# EAGLE design probatio_base (EAGLE 9.4.0)
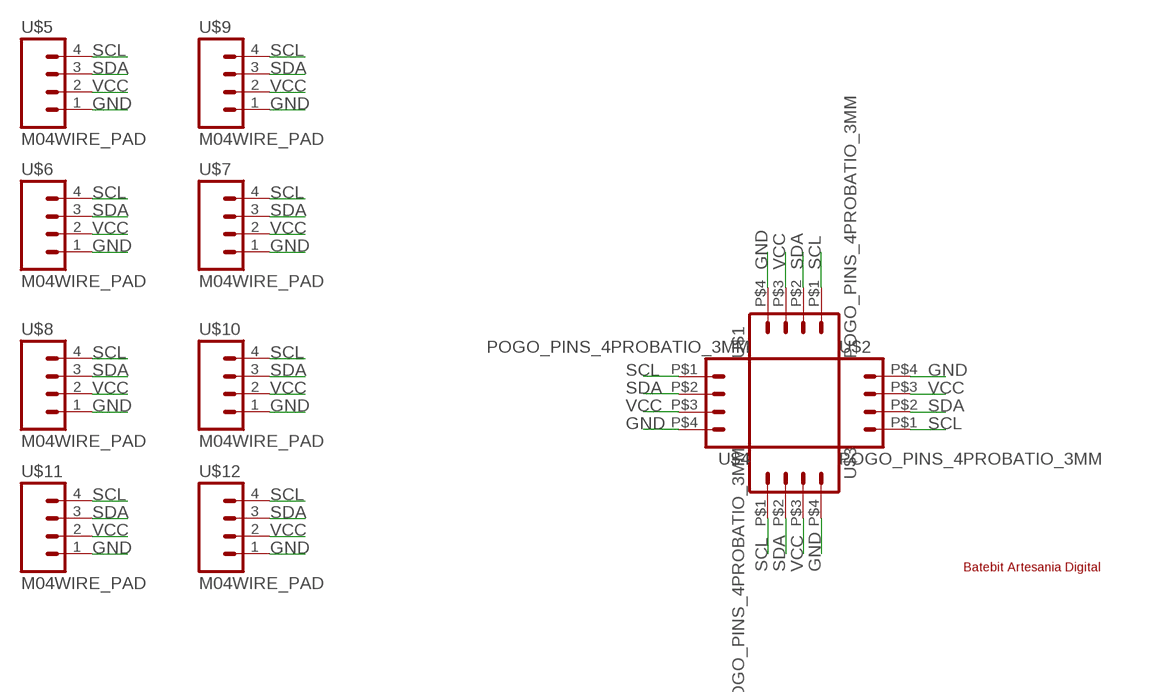
[diagram p0: schematic, sheet 1]

## Parts
U$1  POGO_PINS_4PROBATIO_3MM  [POGO-PINS-4]
U$2  POGO_PINS_4PROBATIO_3MM  [POGO-PINS-4]
U$3  POGO_PINS_4PROBATIO_3MM  [POGO-PINS-4]
U$4  POGO_PINS_4PROBATIO_3MM  [POGO-PINS-4]
U$5  M04WIRE_PAD  [1X04_SMD]
U$6  M04WIRE_PAD  [1X04_SMD]
U$7  M04WIRE_PAD  [1X04_SMD]
U$8  M04WIRE_PAD  [1X04_SMD]
U$9  M04WIRE_PAD  [1X04_SMD]
U$10  M04WIRE_PAD  [1X04_SMD]
U$11  M04WIRE_PAD  [1X04_SMD]
U$12  M04WIRE_PAD  [1X04_SMD]
U$13  BATEBIT_PEQ  [BATEBIT_PEQ]

## Nets
GND: U$1.P$4 U$2.P$4 U$3.P$4 U$4.P$4 U$5.1 U$6.1 U$7.1 U$8.1 U$9.1 U$10.1 U$11.1 U$12.1
SCL: U$1.P$1 U$2.P$1 U$3.P$1 U$4.P$1 U$5.4 U$6.4 U$7.4 U$8.4 U$9.4 U$10.4 U$11.4 U$12.4
SDA: U$1.P$2 U$2.P$2 U$3.P$2 U$4.P$2 U$5.3 U$6.3 U$7.3 U$8.3 U$9.3 U$10.3 U$11.3 U$12.3
VCC: U$1.P$3 U$2.P$3 U$3.P$3 U$4.P$3 U$5.2 U$6.2 U$7.2 U$8.2 U$9.2 U$10.2 U$11.2 U$12.2

## Library data of the parts
U$1-U$4 = Batebit:POGO_PINS_4
U$5-U$12 = Batebit:M04
U$13 = Batebit:BATEBIT

## Board
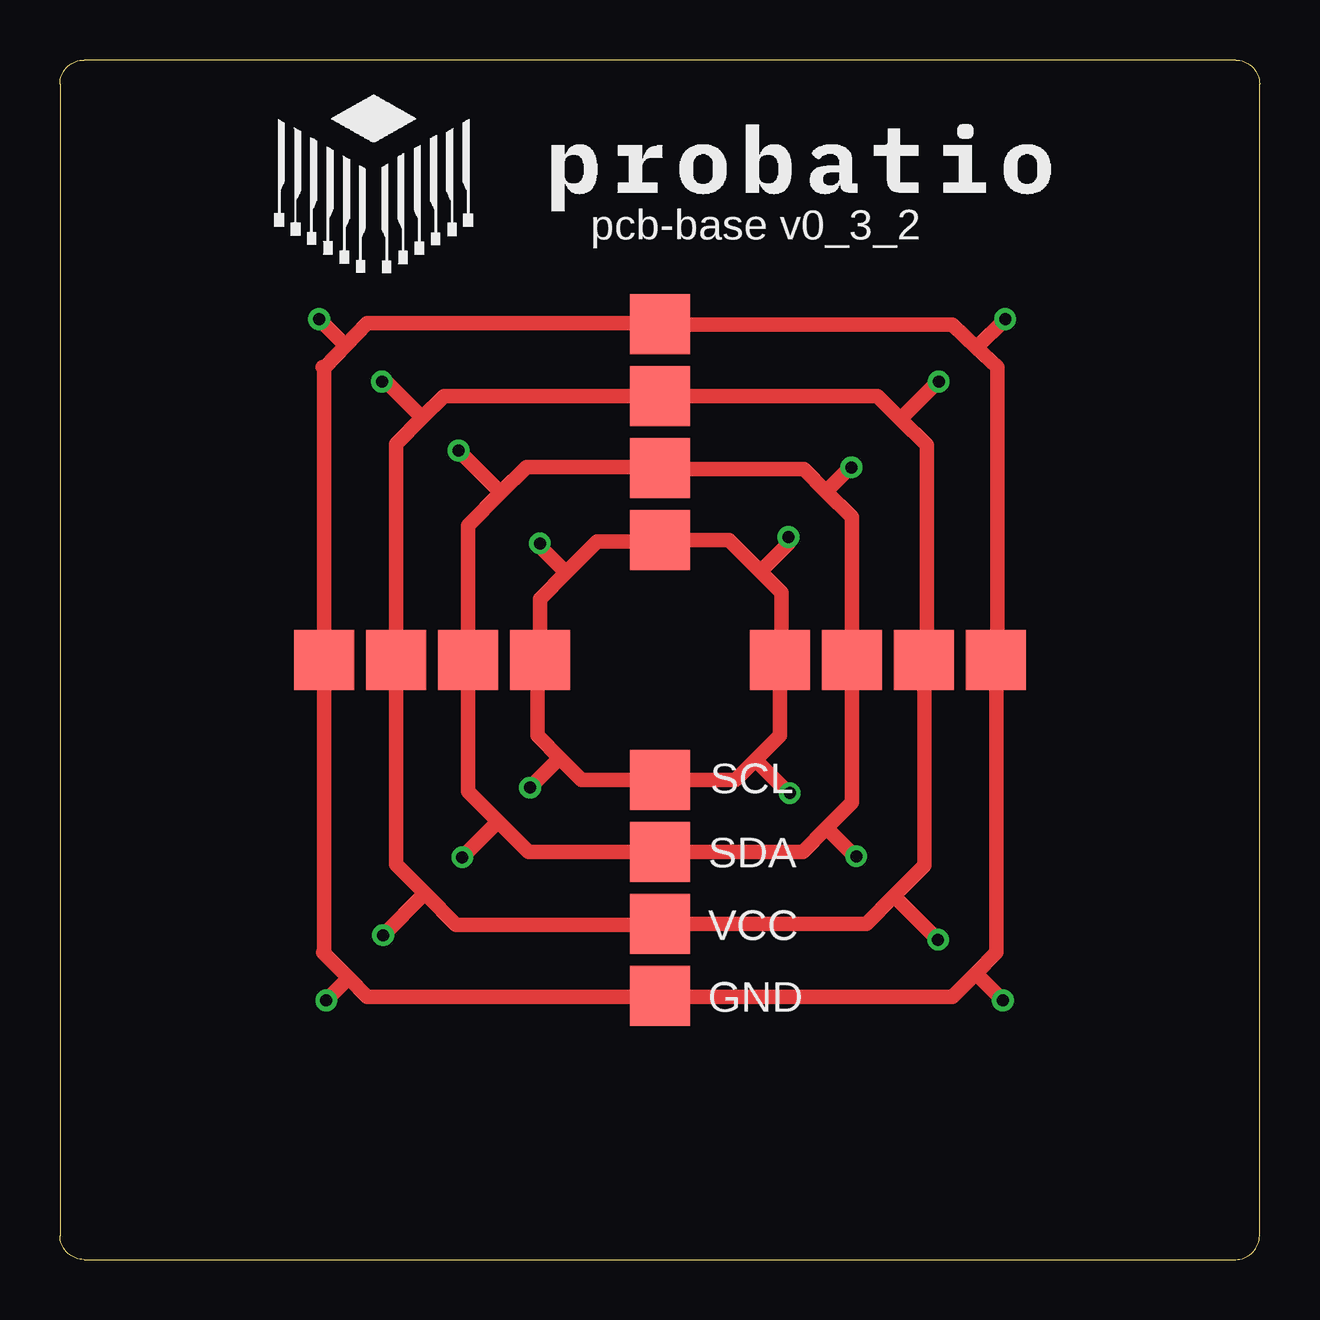
[diagram p1: board, top side]
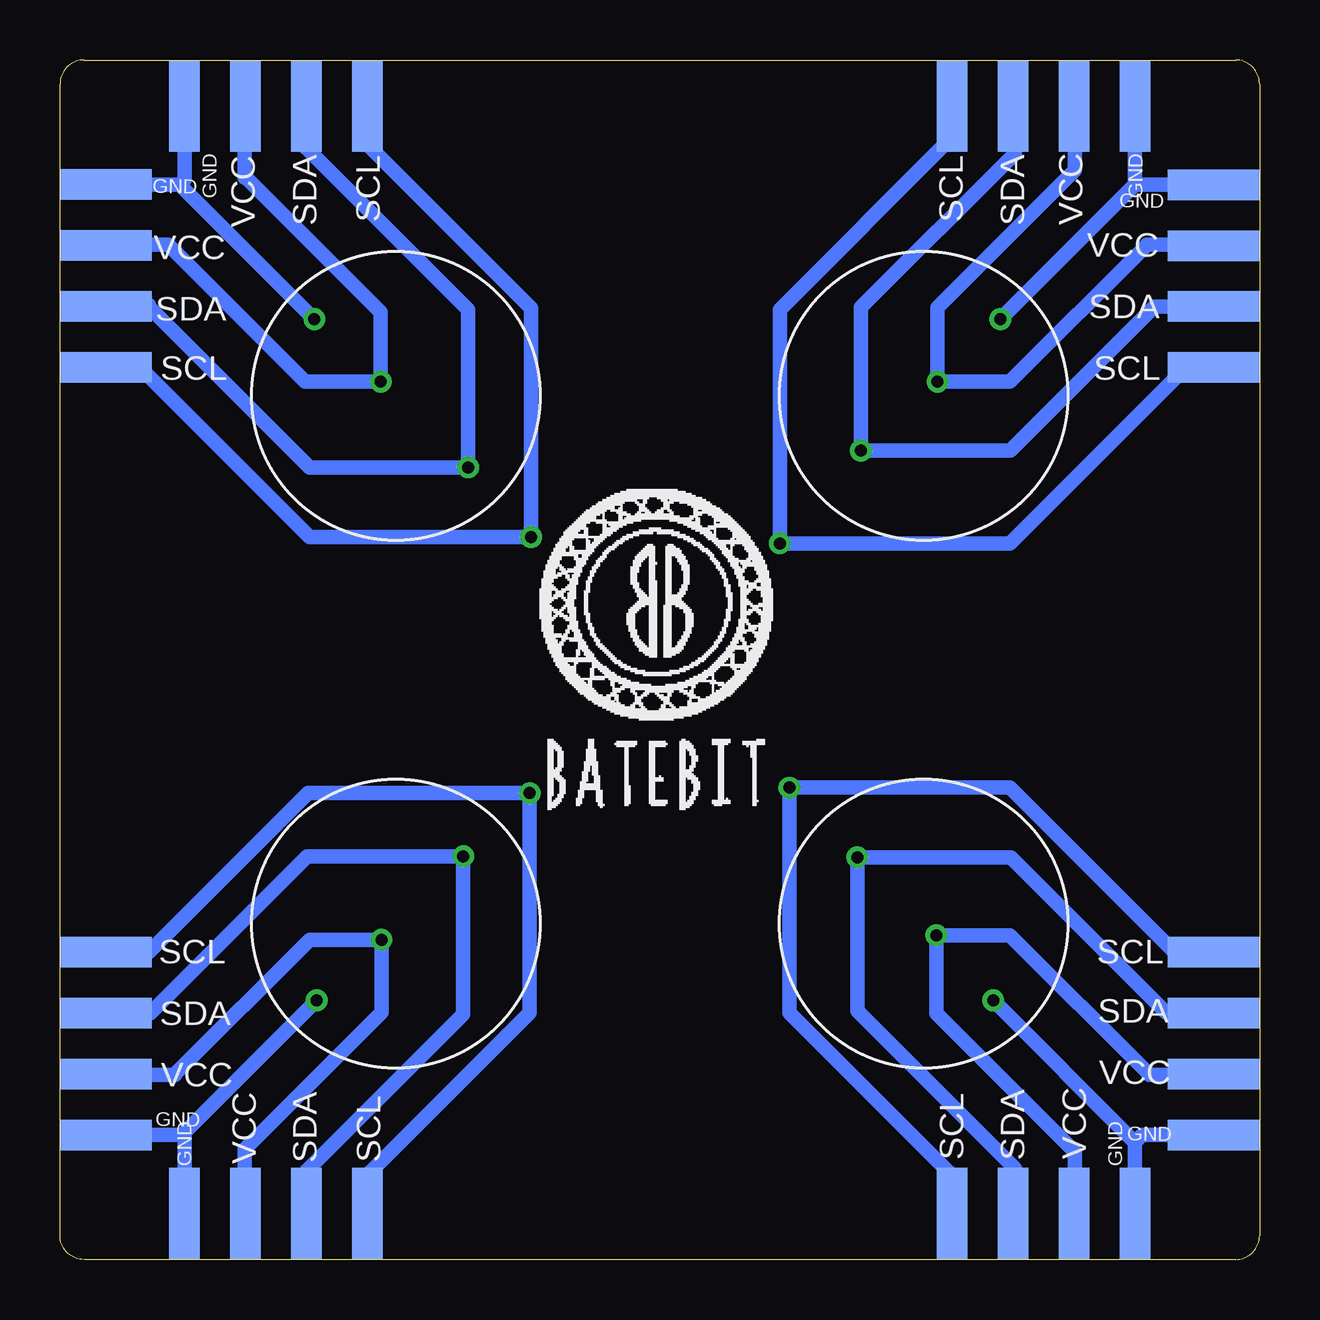
[diagram p2: board, bottom side, seen from below]

Size 50 x 50 mm. Coordinates in mm from the lower left corner, seen from the top.
Outline: 1,0 49,0 arc90 50,1 50,49 arc90 49,50 1,50 arc90 0,49 0,1 arc90 1,0
Copper layers (1*16): Top 0.035mm / dielectric 1.5mm / Bottom 0.035mm
Design rules "default *": minimum track width 6mil, minimum drill 0.35mm, track to track 6mil, track to pad 6mil, pad to pad 6mil, via to via 6mil, smd to smd 6mil, copper to edge 40mil, drill to drill 6mil, minimum pad ring 10mil, minimum via ring 8mil, stop-mask expansion 4mil, vias tented up to drill 20mil, thermal gap 10mil

### Footprints (pad centres in the part's own frame; a part is rotated, then mirrored left to right if it is on the bottom)
POGO-PINS-4 = smd 2.5 x 2.5: P$1 0,0; P$2 3,0; P$3 6,0; P$4 9,0
1X04_SMD = smd 3.81 x 1.27: 1 0,-3.81; 2 0,-1.27; 3 0,1.27; 4 0,3.81

### Placement (x,y rotation side)
U$1  25,20 270 top
U$2  20,25 180 top
U$3  25,30 90 top
U$4  30,25 0 top
U$5  9,48.09 90 bottom
U$6  41,48.09 270 bottom
U$7  48.09,41 180 bottom
U$8  1.91,40.99 180 bottom
U$9  1.91,9 0 bottom
U$10  9,1.91 90 bottom
U$11  41,1.91 270 bottom
U$12  48.09,9 0 bottom
U$13  24.98,26.65 0 bottom
U$14  [PROBATIO]  25,44.7 0 top

### Tracks (layer width: path | path; a pad name or v marks a point on that pad's centre or on a via)
GND  (via drill 0.5)
  Top 0.406: 39,37.12 39.07,37.19 | 25.04,38.96 U$3.P$4 | 11,37.13 11.06,37.19 | 12.83,39 12.8,39.03 | 10.96,12.8 11.38,12.38 | 24.95,10.95 U$1.P$4 26,11 26.05,10.95
  Top 0.61: 38.2,38.01 39.07,37.19 39.07,25.07 | 38.2,38.01 37.19,38.96 26,38.96 | 26,38.96 25.04,38.96 | 11.06,37.19 11.91,38.09 | 11.91,38.09 12.8,39.03 25.93,39.03 26,38.96 | 12.03,11.73 12.81,10.95 24.95,10.95 | 12.03,11.73 11.38,12.38 11,12.76 | 38.17,11.93 37.19,10.95 26.05,10.95 | 38.17,11.93 39.04,12.8 39.04,24.96 39.07,24.99 39.07,25.07 | 10.94,37.19 11,37.13 U$2.P$4 11,12.84 10.96,12.8 | 12.03,11.73 v11.1,10.8 | 38.17,11.93 v39.3,10.8 | 38.2,38.01 v39.4,39.2 | v39.4,39.2 | 11.91,38.09 v10.8,39.2 | U$4.P$4 39.07,25.07
  Bottom 0.61: U$12.1 44.91,5.19 | v39.3,10.8 44.91,5.19 | 44.91,5.19 44.81,5.09 U$11.1 | U$10.1 5.19,4.89 | v11.1,10.8 5.19,4.89 | 5.19,4.89 4.89,5.19 U$9.1 | U$5.1 5.19,44.81 5.2,44.8 | v10.8,39.2 5.2,44.8 | 5.2,44.8 U$8.1 | U$7.1 45.01,44.81 | v39.4,39.2 45.01,44.81 | 45.01,44.81 44.81,45.01 U$6.1
SCL  (via drill 0.5)
  Top 0.406: 24.92,29.92 U$3.P$1 | 30.08,25.08 U$4.P$1 | 19.9,24.9 U$2.P$1 | 20.87,20.87 20.79,20.87 | v30.42,19.44 30.36,19.44
  Top 0.61: U$2.P$1 20,27.54 21.09,28.63 | 21.09,28.63 22.38,29.92 24.92,29.92 | U$3.P$1 27.88,30 29.2,28.68 | 29.2,28.68 30.08,27.8 30.08,25.08 | U$4.P$1 30,21.84 28.98,20.82 | 28.98,20.82 28.16,20 U$1.P$1 21.74,20 20.87,20.87 19.9,21.84 19.9,24.9 | 20.79,20.87 v19.59,19.67 | 30.36,19.44 28.98,20.82 | v30.36,30.11 30.36,29.85 29.2,28.68 | v20,29.85 20,29.72 21.09,28.63
  Bottom 0.61: U$11.4 37.3,2.02 37.3,3.4 30.42,10.28 v30.42,19.44 39.66,19.44 46.3,12.8 U$12.4 | U$10.4 12.8,3.5 19.59,10.29 v19.59,19.67 10.4,19.67 3.4,12.67 3.4,12.6 2.12,12.6 U$9.4 2,12.72 2,12.5 | U$5.4 12.8,46.7 12.9,46.7 20,39.6 v20,29.85 10.4,29.85 3.2,37.05 3.2,37.1 3.12,37.18 U$8.4 | U$6.4 37.4,47.88 37.4,46.7 30.36,39.66 v30.36,30.11 39.6,30.11 46.7,37.21 46.7,37.3 47.98,37.3 U$7.4
SDA  (via drill 0.5)
  Top 0.406: 24.96,33.04 U$3.P$2 25.06,32.94 | U$1.P$2 25.4,17 25.38,16.98 | 33.02,24.98 U$4.P$2 | v33.19,16.81 33.13,16.81 | v32.99,33.02 32.92,33.02
  Top 0.61: 18.36,31.96 17,30.6 U$2.P$2 17,19.51 18.25,18.25 | 18.36,31.96 19.44,33.04 24.96,33.04 | U$4.P$2 33,30.94 31.92,32.02 | 31.92,32.02 31,32.94 25.06,32.94 | 25.4,17 30.97,17 31.95,17.98 | 31.95,17.98 33.02,19.05 33.02,24.98 | 18.25,18.25 19.53,16.98 25.38,16.98 | 18.25,18.25 v16.77,16.77 | 33.13,16.81 31.95,17.98 | 32.92,33.02 31.92,32.02 | v16.61,33.72 18.36,31.96
  Bottom 0.61: U$9.3 1.94,10.3 3.9,10.3 10.37,16.77 v16.77,16.77 16.77,10.37 10.2,3.8 10.2,1.98 U$10.3 | U$11.3 39.73,3.67 33.19,10.21 v33.19,16.81 39.69,16.81 46.23,10.27 U$12.3 | U$5.3 10.2,48.02 10.2,46.1 16.61,39.69 v16.61,33.72 10.38,33.72 4.38,39.72 U$8.3 | U$6.3 39.73,46.33 39.7,46.3 39.69,46.3 32.99,39.6 v32.99,33.02 39.6,33.02 46.3,39.72 46.3,39.8 48.02,39.8 U$7.3
VCC  (via drill 0.5)
  Top 0.152: U$4.P$3 36.04,25.04
  Top 0.406: 15.18,15.23 15.23,15.23 | 36.04,25.04 36.13,25.13 | v36.63,36.59 36.59,36.59 | v13.42,36.59 13.6,36.59
  Top 0.61: 24.95,13.95 16.51,13.95 15.23,15.23 14,16.46 U$2.P$3 14,34 15.1,35.09 | v13.47,13.52 15.18,15.23 | 15.1,35.09 16,36 U$3.P$3 34.08,36 35.04,35.04 | 35.04,35.04 36.13,33.95 36.13,25.13 | 34.77,15.16 33.61,14 U$1.P$3 | 34.77,15.16 36.04,16.43 36.04,25.04 | v36.6,13.33 34.77,15.16 | 36.59,36.59 35.04,35.04 | 13.6,36.59 15.1,35.09
  Bottom 0.61: U$11.2 42.3,1.94 42.3,4.6 36.6,10.3 v36.6,13.33 39.6,13.33 45.2,7.73 45.2,7.7 48.06,7.7 U$12.2 | U$10.2 7.7,1.94 7.7,4.5 13.47,10.27 v13.47,13.52 10.4,13.52 4.6,7.72 4.6,7.7 1.94,7.7 U$9.2 | U$5.2 7.7,48.06 7.7,45.4 13.42,39.68 v13.42,36.59 10.4,36.59 4.7,42.29 4.7,42.3 1.95,42.3 U$8.2 | U$6.2 42.3,48.06 42.3,45.1 42.23,45.1 36.63,39.5 v36.63,36.59 39.79,36.59 45.5,42.3 48.06,42.3 U$7.2

### Text on the board
tPlace: pcb-base v0_3_2 | SCL | SDA | VCC | GND
bPlace: GND | VCC | SDA | SCL | SCL | SDA | VCC | GND | GND | GND | VCC | VCC | SDA | SDA | SCL | SCL | SCL | SCL | SDA | SDA | VCC | VCC | GND | GND | GND | VCC | SDA | SCL | SCL | SDA | VCC | GND